# Altium schematic sheet CH3.SchDoc
size A4
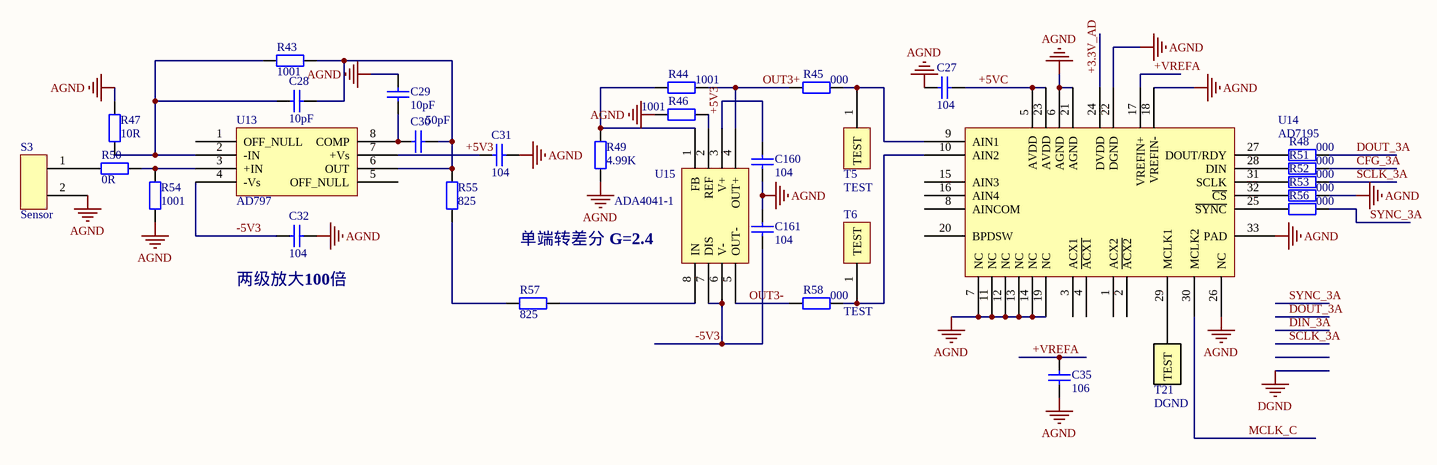
[diagram p0: CH3.SchDoc]

## Parts
C27  104  [0805C]
C28  10pF  [0603]
C29  10pF  [0603]
C30  50pF  [0603]
C31  104  [0805C]
C32  104  [0805C]
C35  106  [0603]
C160  104  [0805C]
C161  104  [0805C]
R43  1001  [0603]  (net tie, no BOM)
R44  1001  [0603]  (net tie, no BOM)
R45  000  [0603]  (net tie, no BOM)
R46  1001  [0603]  (net tie, no BOM)
R47  10R  [0603]
R48  000  [0603]  (net tie, no BOM)
R49  4.99K  [0603]  (net tie, no BOM)
R50  0R  [0603]
R51  000  [0603]  (net tie, no BOM)
R52  000  [0603]  (net tie, no BOM)
R53  000  [0603]  (net tie, no BOM)
R54  1001  [0603]  (net tie, no BOM)
R55  825  [0603]  (net tie, no BOM)
R56  000  [0603]  (net tie, no BOM)
R57  825  [0603]  (net tie, no BOM)
R58  000  [0603]  (net tie, no BOM)
S3  Sensor  [HDR1X2]
T5  TEST  [TEST]
T6  TEST  [TEST]
T21  DGND  [TEST_2]
U13  AD797  [SO8]
U14  AD7195  [VQFN32-1]
U15  ADA4041-1  [SO8]

## Nets
AGND: C27.1 C29.2 C31.1 C32.1 C35.2 C160.2 C161.1 R46.1 R47.1 R49.1 R53.2 R54.1 S3.2 U14.6(AGND) U14.7(NC) U14.11(NC) U14.12(NC) U14.13(NC) U14.14(NC) U14.18(VREFIN-) U14.19(NC) U14.21(AGND) U14.22(DGND) U14.26(NC) U14.33(PAD)
+3.3V_AD: U14.24(DVDD)
+5V3: C31.2 C160.1 U13.7(+Vs) U15.3(V+)
+5VC: C27.2 U14.5(AVDD) U14.23(AVDD)
+VREFA: C35.1 U14.17(VREFIN+)
-5V3: C32.2 C161.2 U13.4(-Vs) U15.6(V-) U15.7(DIS)
CFG_3A: R51.2
DOUT_3A: R48.2
MCLK_C: U14.30(MCLK2)
OUT3+: R44.2 R45.1 U15.4(OUT+)
OUT3-: R58.1 U15.5(OUT-)
SCLK_3A: R52.2
SYNC_3A: R56.2
NetC28_1: C28.1 C30.1 R43.2 R55.2 U13.6(OUT)
NetC28_2: C28.2 R43.1 R47.2 U13.2(-IN)
NetC29_1: C29.1 C30.2 U13.8(COMP)
NetR44_1: R44.1 R49.2 U15.1(FB)
NetR45_2: R45.2 T5.1(TEST) U14.9(AIN1)
NetR46_2: R46.2 U15.2(REF)
NetR48_1: R48.1 U14.27(DOUT/RDY)
NetR50_1: R50.1 S3.1
NetR50_2: R50.2 R54.2 U13.3(+IN)
NetR51_1: R51.1 U14.28(DIN)
NetR52_1: R52.1 U14.31(SCLK)
NetR53_1: R53.1 U14.32(~{CS})
NetR55_1: R55.1 R57.1
NetR56_1: R56.1 U14.25(~{SYNC})
NetR57_2: R57.2 U15.8(IN)
NetR58_2: R58.2 T6.1(TEST) U14.10(AIN2)
NetT21_1: T21.1(TEST) U14.29(MCLK1)

Not connected (* = marked no-connect by the designer): U13 1(OFF_NULL) 5(OFF_NULL); U14 1(ACX2) 2(~{ACX2}) 3(ACX1) 4(~{ACX1}) 8(AINCOM) 15(AIN3) 16(AIN4) 20(BPDSW)

## Notes on the sheet
- 单端转差分 G=2.4
- (near C32) 两级放大100倍

## Library data of the parts
C27-C32 C35 C160 C161 = Cap: Capacitor; Value: 100nF; Published: 8-Jun-2000; LatestRevisionDate: 17-Jul-2002; LatestRevisionNote: Re-released for DXP Platform.; PackageReference: RAD-0.3; Publisher: Altium Limited
R43-R49 R51-R58 = Res2: Resistor; Value: 1K; Published: 8-Jun-2000; LatestRevisionDate: 17-Jul-2002; LatestRevisionNote: Re-released for DXP Platform.; PackageReference: AXIAL-0.4; Publisher: Altium Limited
R50 = Res2: Resistor; Value: 0; Published: 8-Jun-2000; LatestRevisionDate: 17-Jul-2002; LatestRevisionNote: Re-released for DXP Platform.; PackageReference: AXIAL-0.4; Publisher: Altium Limited
T21 = TEST